# EasyEDA Pro project placa_sch.epro

# Schematic PLACA_25

## Sheets
1 Adaptacion analogica: Board Name: PLACA_25; Create Date: 2025-04-01; Page Name: Adaptacion analogica; Project Name: Placa_electronica_25; Schematic Name: PLACA_25; Update Date: 2025-04-07; Company: DINEL; Drawn: MAPE; Page Size: A4; Reviewed: MAPE; Version: V1.0
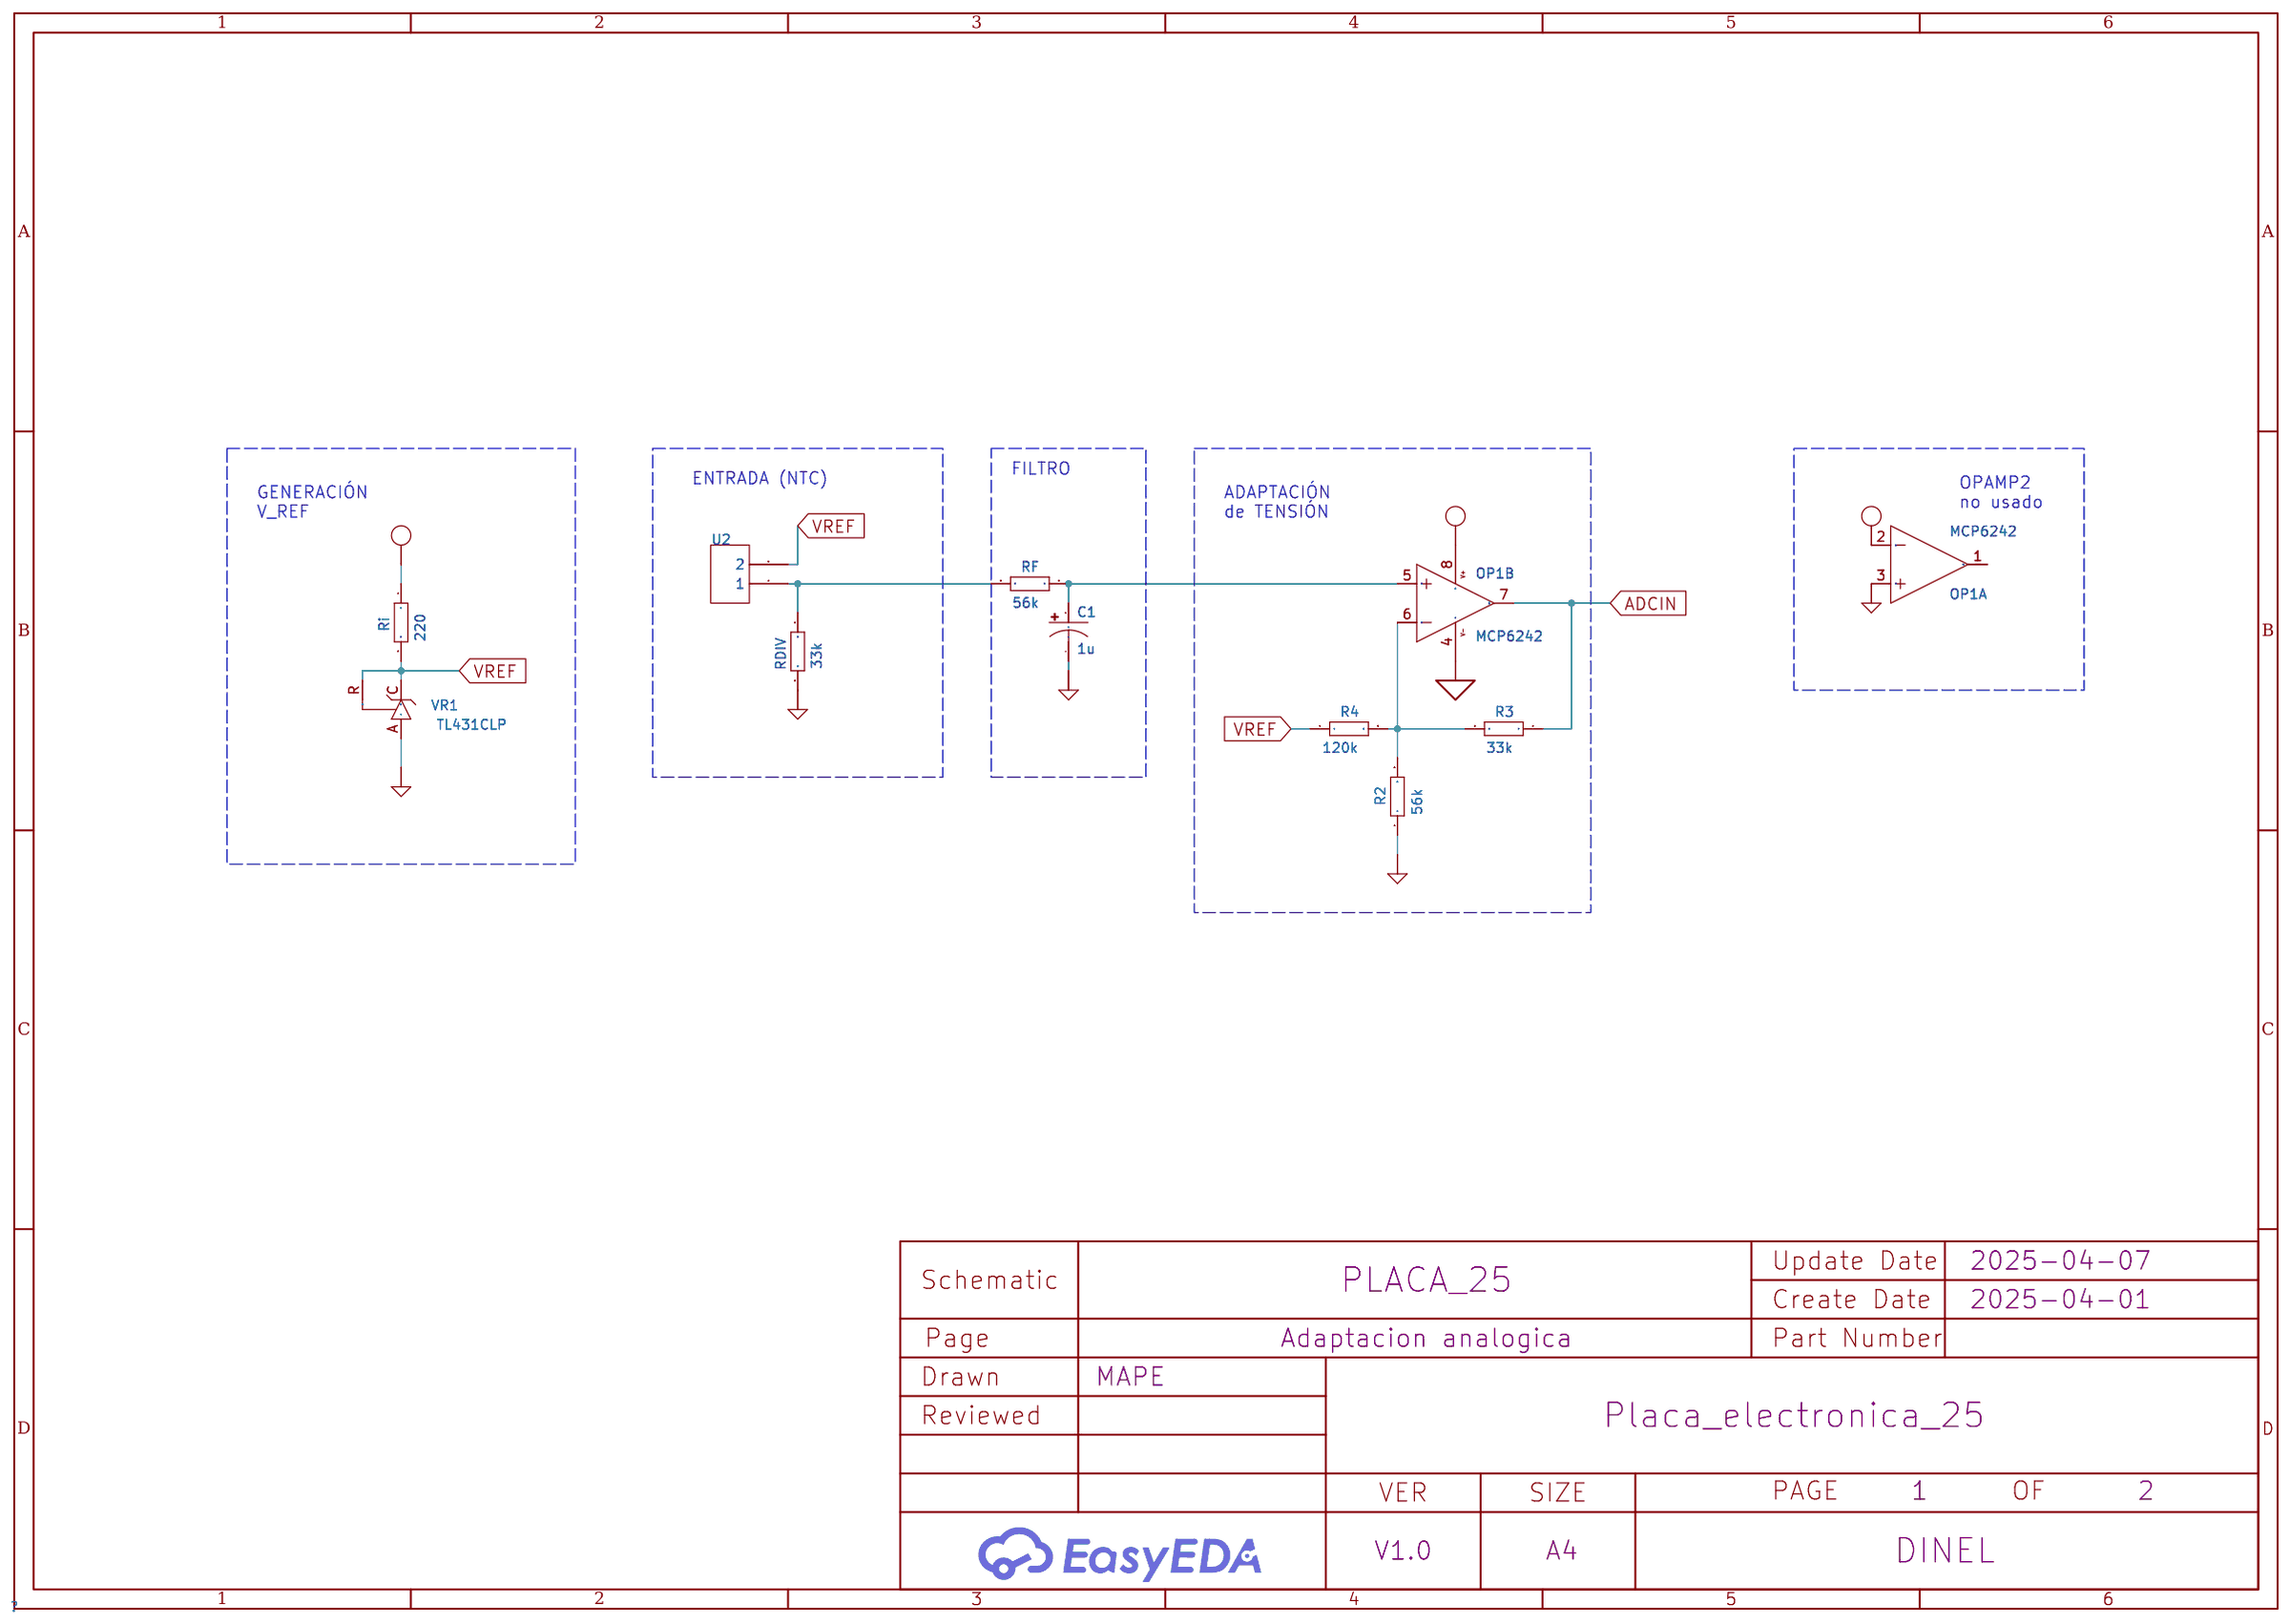
[diagram p0: Adaptacion analogica]
2 Parte digital: Create Date: 2025-04-05; Page Name: Parte digital; Company: EasyEDA.com
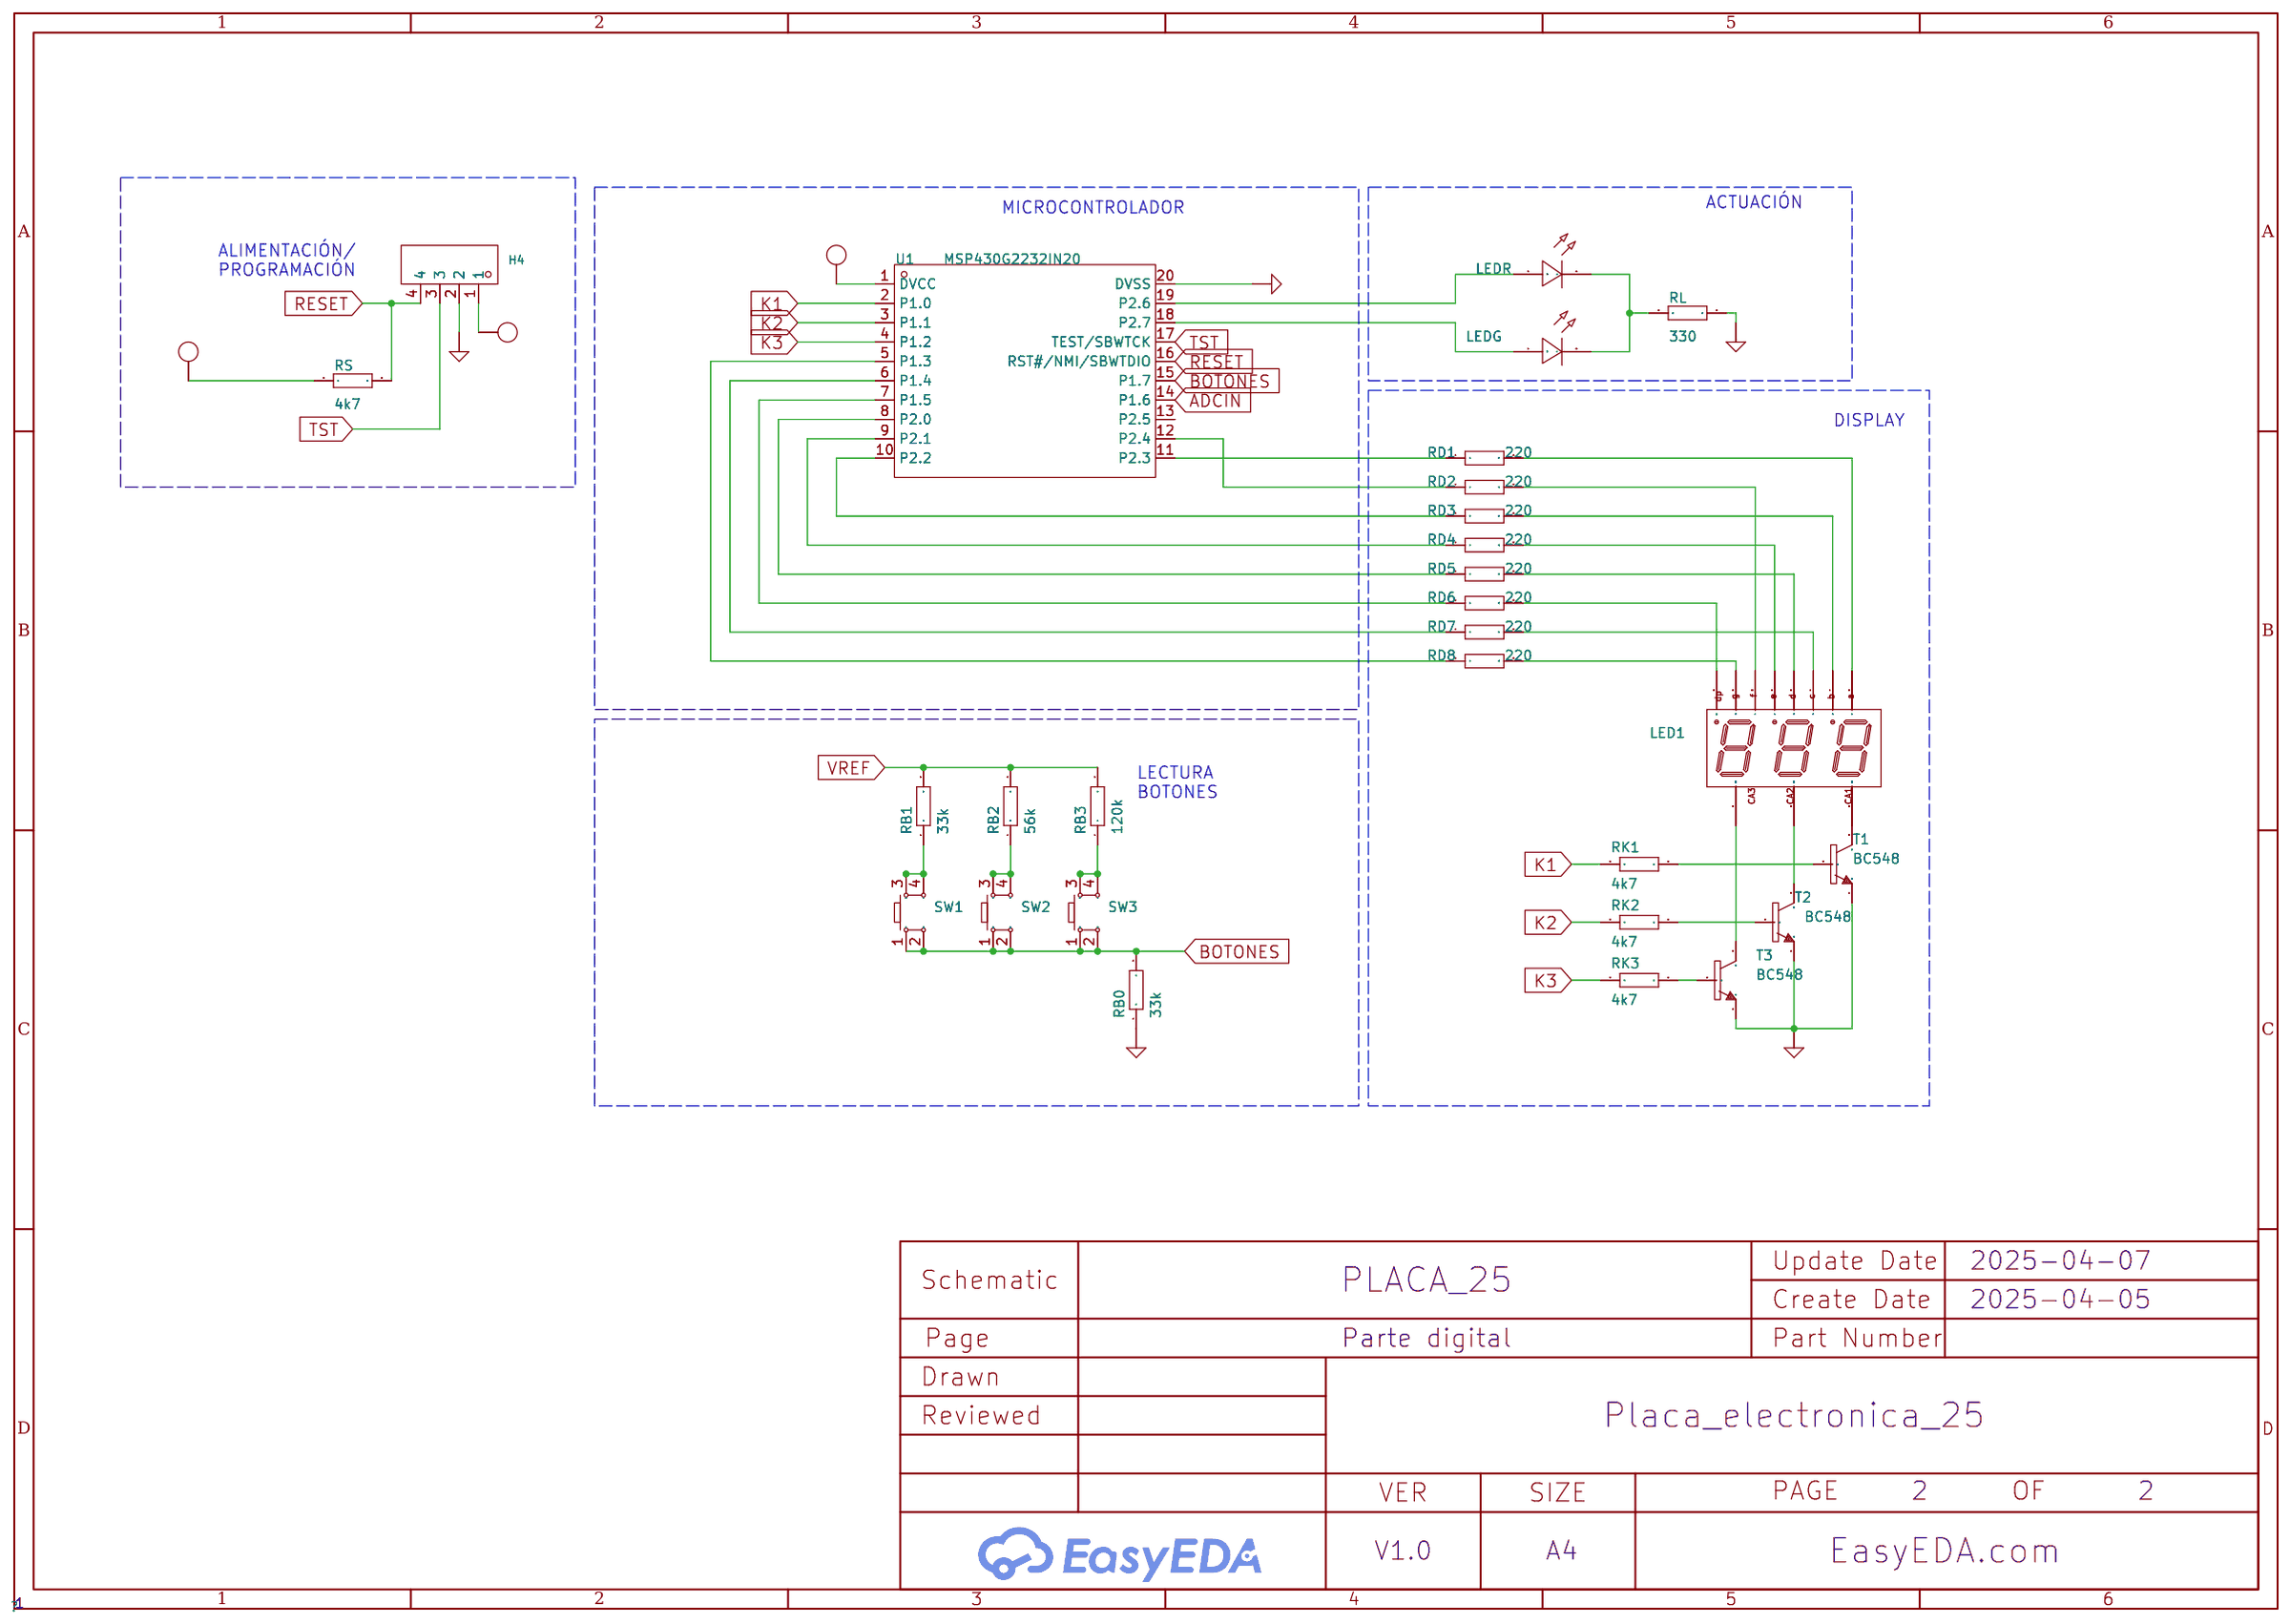
[diagram p1: Parte digital]

## Parts
sheet Adaptacion analogica
C1  1u  [E2,5-6E]
OP1  MCP6242  [DIL8_MOD]  (sections G$1,G$2)
R2  56k  [RESISTOR 1/4W]
R3  33k  [RESISTOR 1/4W]
R4  120k  [RESISTOR 1/4W]
RDIV  33k  [RESISTOR 1/4W]
RF  56k  [RESISTOR 1/4W]
Ri  220  [RESISTOR 1/4W]
U2  -  [AK500/2]
VR1  TL431CLP  [TO93_VR]
sheet Parte digital
H4  -  [4POL254]
LED1  B?56-12EWAA  [BX56-12]
LEDG  -  [LED-TH_BD5.8-P2.54-FD]
LEDR  -  [LED-TH_BD5.8-P2.54-FD]
RB0  33k  [RESISTOR 1/4W]
RB1  33k  [RESISTOR 1/4W]
RB2  56k  [RESISTOR 1/4W]
RB3  120k  [RESISTOR 1/4W]
RD1  220  [RESISTOR 1/4W]
RD2  220  [RESISTOR 1/4W]
RD3  220  [RESISTOR 1/4W]
RD4  220  [RESISTOR 1/4W]
RD5  220  [RESISTOR 1/4W]
RD6  220  [RESISTOR 1/4W]
RD7  220  [RESISTOR 1/4W]
RD8  220  [RESISTOR 1/4W]
RK1  4k7  [RESISTOR 1/4W]
RK2  4k7  [RESISTOR 1/4W]
RK3  4k7  [RESISTOR 1/4W]
RL  330  [RESISTOR 1/4W]
RS  4k7  [RESISTOR 1/4W]
SW1  -  [KEY-TH_4P-L6.0-W6.0-P3.90-LS6.5]
SW2  -  [KEY-TH_4P-L6.0-W6.0-P3.90-LS6.5]
SW3  -  [KEY-TH_4P-L6.0-W6.0-P3.90-LS6.5]
T1  BC548  [TO92-EBC]
T2  BC548  [TO92-EBC]
T3  BC548  [TO92-EBC]
U1  MSP430G2232IN20  [N20]

## Library data of the parts
C1 = rcl_CPOL-US_E2,5-6E
OP1 = linear_MCP6242_CONPADGORDO
R2-R4 RB0-RB3 RD1-RD8 RDIV RF Ri RK1-RK3 RL RS = resistor_mod2_R-EU__0207/10
U2 = 5.08mm pitch connector: RS: 361-7544; _: 3
VR1 = placa2caras_CTO4_TL431CLP_
H4 = HDR-F_2.54_1x4P: Supplier Footprint: Through
LED1 = display-kingbright_B?56-12*WA_A
LEDG LEDR = LED_TH-R_5mm: Supplier Footprint: Through
SW1-SW3 = Key_TH_6x6x4.5: Supplier Footprint: Through
T1-T3 = transistor-npn_BC548*_
U1 = MSP430G2232IN20: CPU Core:MSP430 Program Storage Size:2KB GPIO Ports Number:16 Operating Voltage Range:1.8V~3.6V Operating Voltage Range:1.8V~3.6V CPU Maximum Speed:16MHz Program Memory Type:FLASH Operating Temperature Range:-40℃~+85℃ Operating Temperature Range:-40℃~+85℃; LCSC Part Name: 具有 2KB 闪存、256B SRAM、10 位 ADC、SPI/I2C 和计时器的 16MHz MCU; Supplier Part: C1340883; Manufacturer: TI(德州仪器); Supplier Footprint: PDIP-20; JLCPCB Part Class: Extended Part; Datasheet: https://www.ti.com/cn/lit/gpn/msp430g2402; Supplier: LCSC; CPU Core: MSP430; Program Storage Size: 2KB; GPIO Ports Number: 16; Operating Voltage Range: 1.8V~3.6V; CPU Maximum Speed: 16MHz; Program Memory Type: FLASH; Operating Temperature Range: -40℃~+85℃; ADC (Bit): 10bit; Peripheral/Function: PWM；PWM; Watchdog: Yes; Low-Voltage Detect: Yes; Direct Memory Access: Yes; Internal Oscillator: Yes

## Nets
GND: C1.- H4.2 OP1.3(+IN) OP1.4(V-) R2.1 RB0.1 RDIV.2 RL.1 T1.E T2.E T3.E U1.20(DVSS) VR1.A
VCC: H4.1 OP1.2(-IN) OP1.8(V+) Ri.1 RS.1 U1.1(DVCC)
ADCIN: OP1.7(OUT) R3.1 U1.14(P1.6)
BOTONES: RB0.2 SW1.1 SW1.2 SW2.1 SW2.2 SW3.1 SW3.2 U1.15(P1.7)
DP: LED1.3(DP) RD6.2
K1: RK1.1 U1.2(P1.0)
K2: RK2.1 U1.3(P1.1)
K3: RK3.1 U1.4(P1.2)
N$13: OP1.6(-IN) R2.2 R3.2 R4.2
N$15: RDIV.1 RF.2 U2.1
N$17: C1.+ OP1.5(+IN) RF.1
RESET: H4.4 RS.2 U1.16(RST#/NMI/SBWTDIO)
S-A: LED1.11(A) RD1.2
S-B: LED1.7(B) RD3.2
S-C: LED1.4(C) RD7.2
S-D: LED1.2(D) RD5.2
S-E: LED1.1(E) RD4.2
S-F: LED1.10(F) RD2.2
S-G: LED1.5(G) RD8.2
TST: H4.3 U1.17(TEST/SBWTCK)
VREF: R4.1 RB1.2 RB2.2 RB3.2 Ri.2 U2.2 VR1.C VR1.R
Net-(LED1-8): LED1.8(CA@3) T3.C
Net-(LED1-9): LED1.9(CA@2) T2.C
Net-(LED1-12): LED1.12(CA@1) T1.C
Net-(LEDG-1): LEDG.1(C) U1.18(P2.7)
Net-(LEDG-2): LEDG.2(A) LEDR.2(A) RL.2
Net-(LEDR-1): LEDR.1(C) U1.19(P2.6)
Net-(RB1-1): RB1.1 SW1.3 SW1.4
Net-(RB2-1): RB2.1 SW2.3 SW2.4
Net-(RB3-1): RB3.1 SW3.3 SW3.4
Net-(RD1-1): RD1.1 U1.11(P2.3)
Net-(RD2-1): RD2.1 U1.12(P2.4)
Net-(RD3-1): RD3.1 U1.10(P2.2)
Net-(RD4-1): RD4.1 U1.9(P2.1)
Net-(RD5-1): RD5.1 U1.8(P2.0)
Net-(RD6-1): RD6.1 U1.7(P1.5)
Net-(RD7-1): RD7.1 U1.6(P1.4)
Net-(RD8-1): RD8.1 U1.5(P1.3)
Net-(RK1-2): RK1.2 T1.B
Net-(RK2-2): RK2.2 T2.B
Net-(RK3-2): RK3.2 T3.B

Not connected (* = marked no-connect by the designer): OP1 1(OUT); U1 13(P2.5)

## Notes on the sheets
sheet 1
- FILTRO
- OPAMP2
  no usado
- GENERACIÓN
  V_REF
- ENTRADA (NTC)
- ADAPTACIÓN
  de TENSIÓN
sheet 2
- ACTUACIÓN
- MICROCONTROLADOR
- ALIMENTACIÓN/
  PROGRAMACIÓN
- DISPLAY
- LECTURA
  BOTONES
